# Altium schematic sheet KEY.SchDoc
size A4
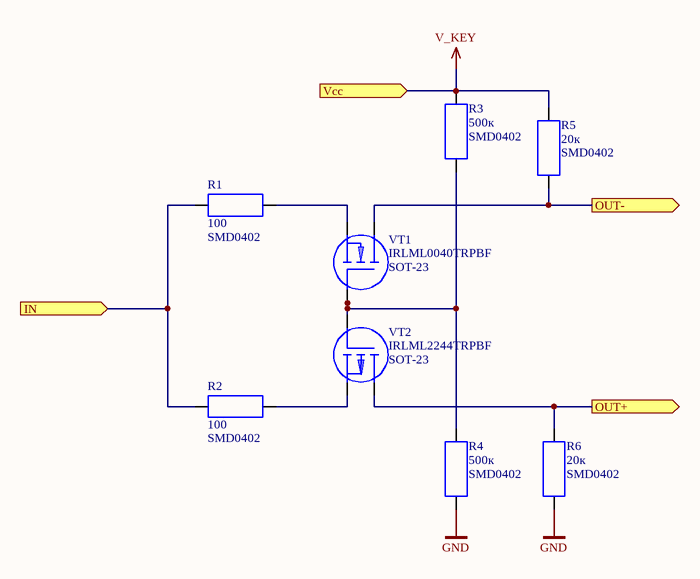
[diagram p0: KEY.SchDoc]

## Parts
R1  100  Package: SMD0402  [SMD0402(1608)]
R2  100  Package: SMD0402  [SMD0402(1608)]
R3  500к  Package: SMD0402  [SMD0402(1608)]
R4  500к  Package: SMD0402  [SMD0402(1608)]
R5  20к  Package: SMD0402  [SMD0402(1608)]
R6  20к  Package: SMD0402  [SMD0402(1608)]
VT1  IRLML0040TRPBF  Package: SOT-23  [SOT23-3]
VT2  IRLML2244TRPBF  Package: SOT-23  [SOT23-3]

## Ports
IN (in), OUT+ (out), OUT- (out), Vcc (in)

## Nets
GND: R4.2 R6.2
V_KEY: R3.1 R5.1 ; port Vcc
IN: R1.2 R2.2 ; port IN
OUT+: R6.1 VT2.3 ; port OUT+
OUT-: R5.2 VT1.3 ; port OUT-
NetR1_1: R1.1 VT1.2
NetR2_1: R2.1 VT2.2
NetR3_2: R3.2 R4.1 VT1.1 VT2.1

## Library data of the parts
R1 R2 = R_0402: ValueBOM: Резистор 100 Ом SMD 0402 1%; Type: R; Value: 100
R3 R4 = R_0402: ValueBOM: Резистор 500кОм SMD 0402 1%; Type: R; Value: 500к
R5 R6 = R_0402: ValueBOM: Резистор 20кОм SMD 0402 1%; Type: R; Value: 20к
VT1 = VT_N_MOSFET_SOT23_3: Type: VT; ValueBOM: Транзистор n-МОП IRLML0040TRPBF SOT23; Value: IRLML0040TRPBF
VT2 = VT_P_MOSFET_SOT23_3: Type: VT; ValueBOM: Транзистор p-МОП IRLML2244TRPBF SOT23; Value: IRLML2244TRPBF